# EAGLE design 2MB_Simplified (EAGLE 7.7.0)
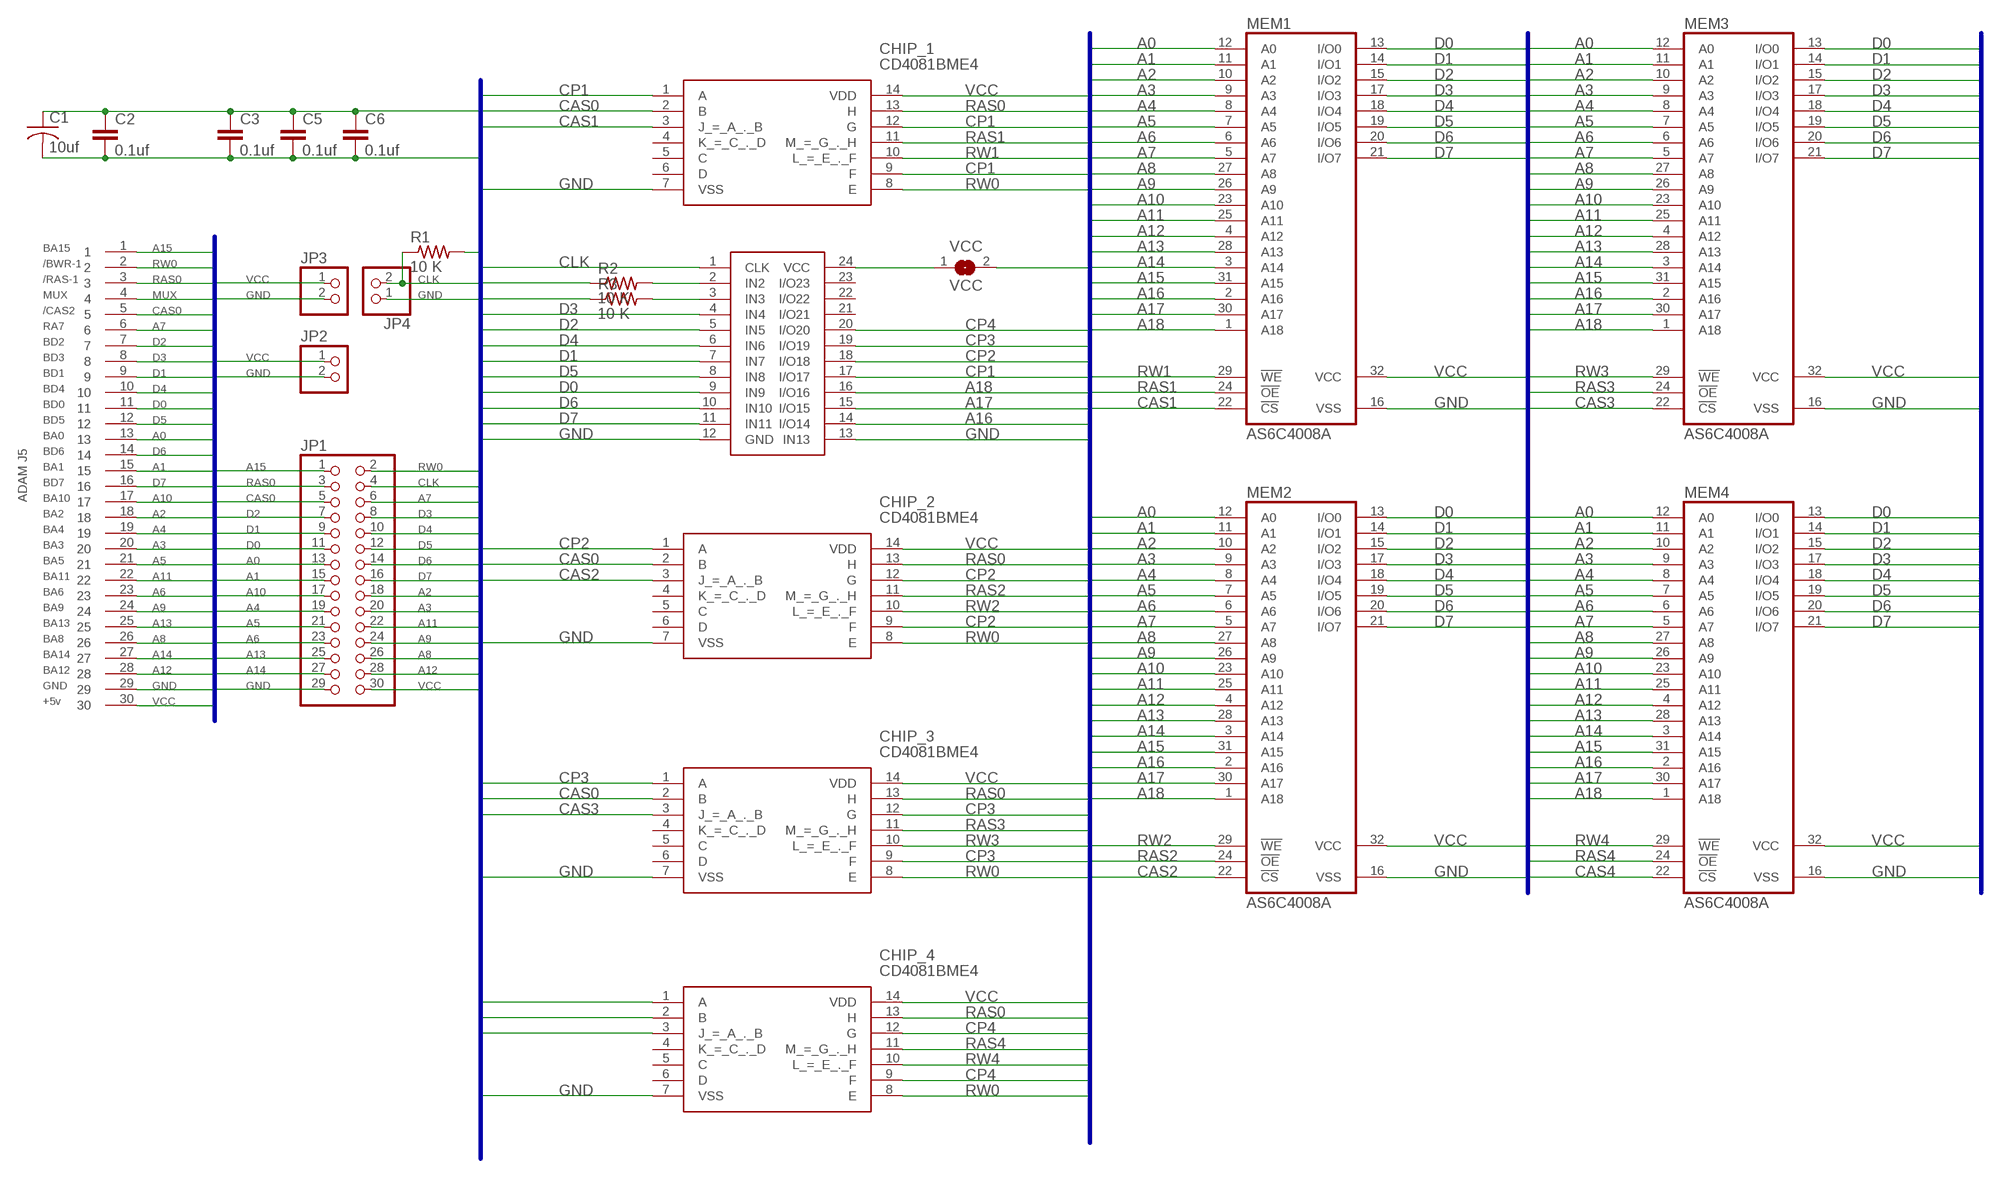
[diagram p0: schematic, sheet 1]

## Parts
C1  10uf  C-US050-025X075  [C050-025X075]
C2  0.1uf  C-EUC1206  [C1206]
C3  0.1uf  C-EUC1206  [C1206]
C5  0.1uf  C-EUC1206  [C1206]
C6  0.1uf  C-EUC1206  [C1206]
CHIP_1  CD4081BME4  [SOIC127P600X175-14N]
CHIP_2  CD4081BME4  [SOIC127P600X175-14N]
CHIP_3  CD4081BME4  [SOIC127P600X175-14N]
CHIP_4  CD4081BME4  [SOIC127P600X175-14N]
JP1  PINHD-2X15  [2X15]
JP2  PINHD-1X2  [1X02]
JP3  PINHD-1X2  [1X02]
JP4  PINHD-1X2  [1X02]
MEM1  AS6C4008A  [SOP32-V2]
MEM2  AS6C4008A  [SOP32-V2]
MEM3  AS6C4008A  [SOP32-V2]
MEM4  AS6C4008A  [SOP32-V2]
R1  10 K  R-US_M1206  [M1206]
R2  10 K  R-US_M1206  [M1206]
R3  10 K  R-US_M1206  [M1206]
U$3  J5CARD  [J5CARD]
U$6  ATF22V10  [SO24W]
VCC  VCC  SJ  [SJ]

## Nets
A0: JP1.13 MEM1.12(A0) MEM2.12(A0) MEM3.12(A0) MEM4.12(A0) U$3.13
A1: JP1.15 MEM1.11(A1) MEM2.11(A1) MEM3.11(A1) MEM4.11(A1) U$3.15
A2: JP1.18 MEM1.10(A2) MEM2.10(A2) MEM3.10(A2) MEM4.10(A2) U$3.18
A3: JP1.20 MEM1.9(A3) MEM2.9(A3) MEM3.9(A3) MEM4.9(A3) U$3.20
A4: JP1.19 MEM1.8(A4) MEM2.8(A4) MEM3.8(A4) MEM4.8(A4) U$3.19
A5: JP1.21 MEM1.7(A5) MEM2.7(A5) MEM3.7(A5) MEM4.7(A5) U$3.21
A6: JP1.23 MEM1.6(A6) MEM2.6(A6) MEM3.6(A6) MEM4.6(A6) U$3.23
A7: JP1.6 MEM1.5(A7) MEM2.5(A7) MEM3.5(A7) MEM4.5(A7) U$3.6
A8: JP1.26 MEM1.27(A8) MEM2.27(A8) MEM3.27(A8) MEM4.27(A8) U$3.26
A9: JP1.24 MEM1.26(A9) MEM2.26(A9) MEM3.26(A9) MEM4.26(A9) U$3.24
A10: JP1.17 MEM1.23(A10) MEM2.23(A10) MEM3.23(A10) MEM4.23(A10) U$3.17
A11: JP1.22 MEM1.25(A11) MEM2.25(A11) MEM3.25(A11) MEM4.25(A11) U$3.22
A12: JP1.28 MEM1.4(A12) MEM2.4(A12) MEM3.4(A12) MEM4.4(A12) U$3.28
A13: JP1.25 MEM1.28(A13) MEM2.28(A13) MEM3.28(A13) MEM4.28(A13) U$3.25
A14: JP1.27 MEM1.3(A14) MEM2.3(A14) MEM3.3(A14) MEM4.3(A14) U$3.27
A15: JP1.1 MEM1.31(A15) MEM2.31(A15) MEM3.31(A15) MEM4.31(A15) U$3.1
A16: MEM1.2(A16) MEM2.2(A16) MEM3.2(A16) MEM4.2(A16) U$6.14(I/O14)
A17: MEM1.30(A17) MEM2.30(A17) MEM3.30(A17) MEM4.30(A17) U$6.15(I/O15)
A18: MEM1.1(A18) MEM2.1(A18) MEM3.1(A18) MEM4.1(A18) U$6.16(I/O16)
CAS0: CHIP_1.2(B) CHIP_2.2(B) CHIP_3.2(B) CHIP_4.2(B) JP1.5 U$3.5
CAS1: CHIP_1.3(J_=_A_._B) MEM1.22(!CS)
CAS2: CHIP_2.3(J_=_A_._B) MEM2.22(!CS)
CAS3: CHIP_3.3(J_=_A_._B) MEM3.22(!CS)
CAS4: CHIP_4.3(J_=_A_._B) MEM4.22(!CS)
CLK: JP1.4 JP4.2 R1.1 U$6.1(CLK)
CP1: CHIP_1.1(A) CHIP_1.9(F) CHIP_1.12(G) U$6.17(I/O17)
CP2: CHIP_2.1(A) CHIP_2.9(F) CHIP_2.12(G) U$6.18(I/O18)
CP3: CHIP_3.1(A) CHIP_3.9(F) CHIP_3.12(G) U$6.19(I/O19)
CP4: CHIP_4.1(A) CHIP_4.9(F) CHIP_4.12(G) U$6.20(I/O20)
D0: JP1.11 MEM1.13(I/O0) MEM2.13(I/O0) MEM3.13(I/O0) MEM4.13(I/O0) U$3.11 U$6.9(IN9)
D1: JP1.9 MEM1.14(I/O1) MEM2.14(I/O1) MEM3.14(I/O1) MEM4.14(I/O1) U$3.9 U$6.7(IN7)
D2: JP1.7 MEM1.15(I/O2) MEM2.15(I/O2) MEM3.15(I/O2) MEM4.15(I/O2) U$3.7 U$6.5(IN5)
D3: JP1.8 MEM1.17(I/O3) MEM2.17(I/O3) MEM3.17(I/O3) MEM4.17(I/O3) U$3.8 U$6.4(IN4)
D4: JP1.10 MEM1.18(I/O4) MEM2.18(I/O4) MEM3.18(I/O4) MEM4.18(I/O4) U$3.10 U$6.6(IN6)
D5: JP1.12 MEM1.19(I/O5) MEM2.19(I/O5) MEM3.19(I/O5) MEM4.19(I/O5) U$3.12 U$6.8(IN8)
D6: JP1.14 MEM1.20(I/O6) MEM2.20(I/O6) MEM3.20(I/O6) MEM4.20(I/O6) U$3.14 U$6.10(IN10)
D7: JP1.16 MEM1.21(I/O7) MEM2.21(I/O7) MEM3.21(I/O7) MEM4.21(I/O7) U$3.16 U$6.11(IN11)
GND [GND]: C1.2 C2.2 C3.2 C5.2 C6.2 CHIP_1.7(VSS) CHIP_2.7(VSS) CHIP_3.7(VSS) CHIP_4.7(VSS) JP1.29 JP2.2 JP3.2 JP4.1 MEM1.16(VSS) MEM2.16(VSS) MEM3.16(VSS) MEM4.16(VSS) R1.2 R2.1 R3.1 U$3.29 U$6.12(GND) U$6.13(IN13)
MUX: U$3.4
N$1: R2.2 U$6.2(IN2)
N$2: R3.2 U$6.3(IN3)
N$3: U$6.24(VCC) VCC.1
RAS0: CHIP_1.13(H) CHIP_2.13(H) CHIP_3.13(H) CHIP_4.13(H) JP1.3 U$3.3
RAS1: CHIP_1.11(M_=_G_._H) MEM1.24(!OE)
RAS2: CHIP_2.11(M_=_G_._H) MEM2.24(!OE)
RAS3: CHIP_3.11(M_=_G_._H) MEM3.24(!OE)
RAS4: CHIP_4.11(M_=_G_._H) MEM4.24(!OE)
RW0: CHIP_1.8(E) CHIP_2.8(E) CHIP_3.8(E) CHIP_4.8(E) JP1.2 U$3.2
RW1: CHIP_1.10(L_=_E_._F) MEM1.29(!WE)
RW2: CHIP_2.10(L_=_E_._F) MEM2.29(!WE)
RW3: CHIP_3.10(L_=_E_._F) MEM3.29(!WE)
RW4: CHIP_4.10(L_=_E_._F) MEM4.29(!WE)
VCC [VCC]: C1.1 C2.1 C3.1 C5.1 C6.1 CHIP_1.14(VDD) CHIP_2.14(VDD) CHIP_3.14(VDD) CHIP_4.14(VDD) JP1.30 JP2.1 JP3.1 MEM1.32(VCC) MEM2.32(VCC) MEM3.32(VCC) MEM4.32(VCC) U$3.30 VCC.2
Unconnected: CHIP_1.4(K_=_C_._D) CHIP_1.5(C) CHIP_1.6(D) CHIP_2.4(K_=_C_._D) CHIP_2.5(C) CHIP_2.6(D) CHIP_3.4(K_=_C_._D) CHIP_3.5(C) CHIP_3.6(D) CHIP_4.4(K_=_C_._D) CHIP_4.5(C) CHIP_4.6(D) U$6.21(I/O21) U$6.22(I/O22) U$6.23(I/O23)

## Buses
D[0..7],A[0..18],RW[0..4],CAS[0..4],RAS[0..4],VCC,GND,MUX,CLK,CP[1..4]

## Library data of the parts
C1 = rcl:C-US: CAPACITOR, American symbol
C2 C3 C5 C6 = rcl:C-EU: CAPACITOR, European symbol
CHIP_1-CHIP_4 = SamacSys_Parts:CD4081BME4: Logic Gates Quad 2-Input Source: Datasheet <http://www.ti.com/general/docs/suppproductinfo.tsp?distId=10&gotoUrl=http://www.ti.com/lit/gpn/cd4073b>; DESCRIPTION: Logic Gates Quad 2-Input; HEIGHT: 1.75mm; MANUFACTURER_NAME: Texas Instruments; MANUFACTURER_PART_NUMBER: CD4081BME4; MOUSER_PART_NUMBER: 595-CD4081BME4; MOUSER_PRICE-STOCK: https://www.mouser.co.uk/ProductDetail/Texas-Instruments/CD4081BME4?qs=HTr%252BoA4jRikg%252BQvASI76tw%3D%3D
JP1 = pinhead:PINHD-2X15: PIN HEADER
JP2-JP4 = pinhead:PINHD-1X2: PIN HEADER
MEM1-MEM4 = memory-bsi:AS6C4008A
R1-R3 = resistor:R-US_: RESISTOR, American symbol
U$3 = ADAM:J5CARD: ADAM J5 Peripheral Card Standard 30-pin J5 edge connector for COLECO ADAM
U$6 = atmel:ATF22V10
VCC = jumper:SJ: SMD solder JUMPER

## Board
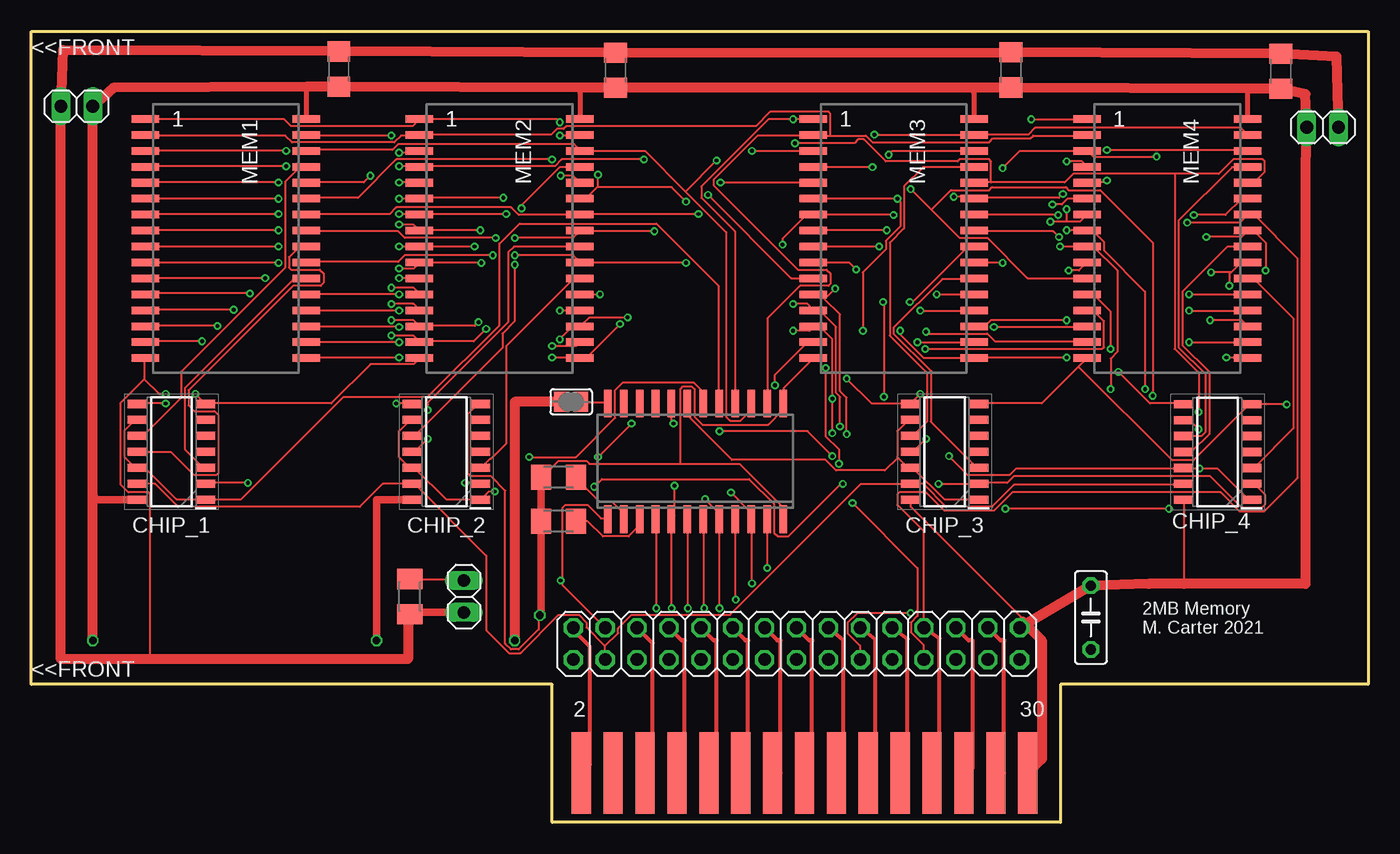
[diagram p1: board, top side]
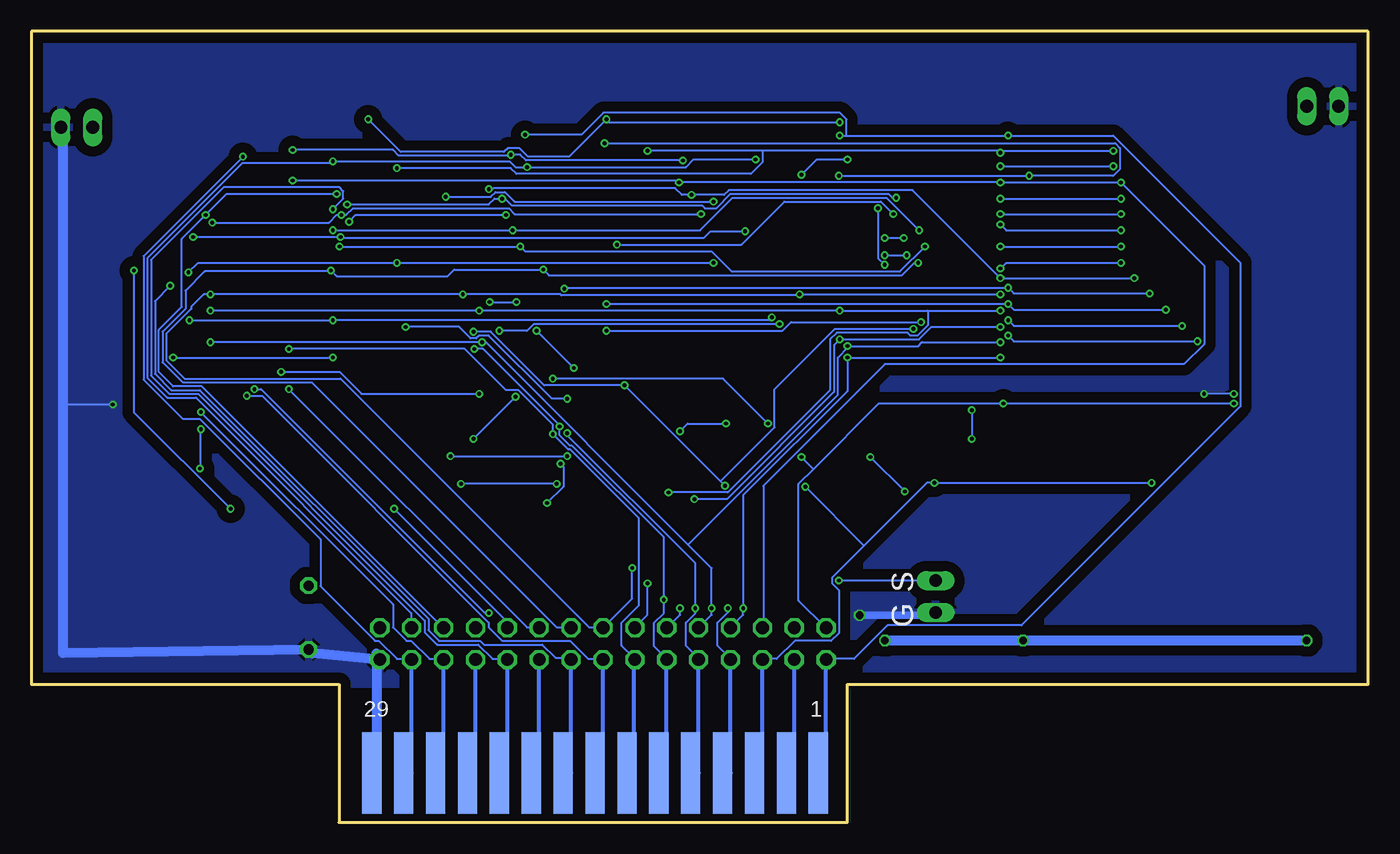
[diagram p2: board, bottom side, seen from below]

Size 106.5 x 63 mm. Coordinates in mm from the lower left corner, seen from the top.
Outline: 41.5,0 41.5,11 0,11 0,63 106.5,63 106.5,11 82,11 82,0 41.5,0
Copper layers (1*16): Top 0.035mm / dielectric 1.5mm / Bottom 0.035mm
Design rules "SeeedStudio_2layer_DRU_no_angle_20140221": minimum track width 6mil, minimum drill 12mil, track to track 6mil, track to pad 6mil, pad to pad 6mil, via to via 6mil, smd to smd 0mil, copper to edge 10mil, drill to drill 10mil, minimum pad ring 10mil, minimum via ring 6mil, stop-mask expansion 2mil, vias tented up to drill 100mil, thermal gap 10mil

### Footprints (pad centres in the part's own frame; a part is rotated, then mirrored left to right if it is on the bottom)
C050-025X075 = drill 0.813 octagon: 1 -2.54,0; 2 2.54,0
C1206 = smd 1.6 x 1.8: 1 -1.4,0; 2 1.4,0
SOIC127P600X175-14N = smd 1.525 x 0.65: 1 -2.712,3.81; 2 -2.712,2.54; 3 -2.712,1.27; 4 -2.712,0; 5 -2.712,-1.27; 6 -2.712,-2.54; 7 -2.712,-3.81; 8 2.712,-3.81; 9 2.712,-2.54; 10 2.712,-1.27; 11 2.712,0; 12 2.712,1.27; 13 2.712,2.54; 14 2.712,3.81
2X15 = drill 1.016 octagon: 1 -17.78,-1.27; 2 -17.78,1.27; 3 -15.24,-1.27; 4 -15.24,1.27; 5 -12.7,-1.27; 6 -12.7,1.27; 7 -10.16,-1.27; 8 -10.16,1.27; 9 -7.62,-1.27; 10 -7.62,1.27; 11 -5.08,-1.27; 12 -5.08,1.27; 13 -2.54,-1.27; 14 -2.54,1.27; 15 0,-1.27; 16 0,1.27; 17 2.54,-1.27; 18 2.54,1.27; 19 5.08,-1.27; 20 5.08,1.27; 21 7.62,-1.27; 22 7.62,1.27; 23 10.16,-1.27; 24 10.16,1.27; 25 12.7,-1.27; 26 12.7,1.27; 27 15.24,-1.27; 28 15.24,1.27; 29 17.78,-1.27; 30 17.78,1.27
1X02 = drill 1.016 long: 1 -1.27,0; 2 1.27,0
SOP32-V2 = smd 0.6 x 2.2: 1 -9.525,-6.4; 2 -8.255,-6.4; 3 -6.985,-6.4; 4 -5.715,-6.4; 5 -4.445,-6.4; 6 -3.175,-6.4; 7 -1.905,-6.4; 8 -0.635,-6.4; 9 0.635,-6.4; 10 1.905,-6.4; 11 3.175,-6.4; 12 4.445,-6.4; 13 5.715,-6.4; 14 6.985,-6.4; 15 8.255,-6.4; 16 9.525,-6.4; 17 9.525,6.4; 18 8.255,6.4; 19 6.985,6.4; 20 5.715,6.4; 21 4.445,6.4; 22 3.175,6.4; 23 1.905,6.4; 24 0.635,6.4; 25 -0.635,6.4; 26 -1.905,6.4; 27 -3.175,6.4; 28 -4.445,6.4; 29 -5.715,6.4; 30 -6.985,6.4; 31 -8.255,6.4; 32 -9.525,6.4
M1206 = smd 1.6 x 2: 1 -1.4,0; 2 1.4,0
J5CARD = smd 1.524 x 6.477 bottom: 1 -73.025,4.445; 3 -70.485,4.445; 5 -67.945,4.445; 7 -65.405,4.445; 9 -62.865,4.445; 11 -60.325,4.445; 13 -57.785,4.445; 15 -55.245,4.445; 17 -52.705,4.445; 19 -50.165,4.445; 21 -47.625,4.445; 23 -45.085,4.445; 25 -42.545,4.445; 27 -40.005,4.445; 29 -37.465,4.445 | smd 1.524 x 6.477: 2 -73.025,4.445; 4 -70.485,4.445; 6 -67.945,4.445; 8 -65.405,4.445; 10 -62.865,4.445; 12 -60.325,4.445; 14 -57.785,4.445; 16 -55.245,4.445; 18 -52.705,4.445; 20 -50.165,4.445; 22 -47.625,4.445; 24 -45.085,4.445; 26 -42.545,4.445; 28 -40.005,4.445; 30 -37.465,4.445
SO24W = smd 0.6 x 2.2: 1 -6.985,-4.6; 2 -5.715,-4.6; 3 -4.445,-4.6; 4 -3.175,-4.6; 5 -1.905,-4.6; 6 -0.635,-4.6; 7 0.635,-4.6; 8 1.905,-4.6; 9 3.175,-4.6; 10 4.445,-4.6; 11 5.715,-4.6; 12 6.985,-4.6; 13 6.985,4.6; 14 5.715,4.6; 15 4.445,4.6; 16 3.175,4.6; 17 1.905,4.6; 18 0.635,4.6; 19 -0.635,4.6; 20 -1.905,4.6; 21 -3.175,4.6; 22 -4.445,4.6; 23 -5.715,4.6; 24 -6.985,4.6
SJ = smd 1.168 x 1.6: 1 -0.762,0; 2 0.762,0

### Placement (x,y rotation side)
C1  84.41,16.32 270 top
C2  46.54,59.9 90 top
C3  24.5,60 90 top
C5  78.04,59.93 90 top
C6  99.54,59.83 90 top
CHIP_1  11.16,29.52 180 top
CHIP_2  33.06,29.52 180 top
CHIP_3  72.76,29.52 180 top
CHIP_4  94.5,29.5 180 top
JP1  60.96,14.24 0 top
JP2  3.62,57.04 180 top
JP3  102.88,55.36 0 top
JP4  34.46,17.99 90 top
MEM1  15.5,46.5 270 top
MEM2  37.3,46.5 270 top
MEM3  68.7,46.5 270 top
MEM4  90.5,46.5 270 top
R1  30.15,17.99 270 top
R2  42,27.5 0 top
R3  42,24 0 top
U$3  116.84,-0.5 0 top
U$6  52.9,28.75 0 top
VCC  43,33.5 180 top

### Tracks (layer width: path | path; a pad name or v marks a point on that pad's centre or on a via)
A0  (via drill 0.3)
  Top 0.152: v17.41,42.13 9.1,42.13 MEM1.12 | v28.68,42.59 30.44,42.59 30.89,42.13 MEM2.12 | 63.2,41.67 64.42,40.45 64.42,34.36 64.96,33.82 v64.96,30.93 | 63.2,41.67 62.82,42.05 62.37,42.05 MEM3.12 | v85.99,37.71 85.99,40.68 84.61,42.05 84.16,42.05 MEM4.12 | 63.2,41.67 v64.04,42.51
  Bottom 0.152: 58.48,4.49 59.01,3.95 U$3.13 | v17.41,42.13 28.23,42.13 v28.68,42.59 63.97,42.59 v64.04,42.51 | JP1.13 58.48,13.1 59.47,14.09 59.47,15.92 58.1,17.29 58.1,24.22 63.58,29.71 63.74,29.71 v64.96,30.93 64.96,31.69 67.7,34.43 68.69,34.43 71.97,37.71 v85.99,37.71
  Bottom 0.305: 58.48,4.49 58.48,12.91 JP1.13
A1  (via drill 0.3)
  Top 0.152: v18.63,43.35 9.1,43.35 MEM1.11 | v29.29,43.35 30.89,43.35 MEM2.11 | v53.91,49.98 60.54,43.35 62.29,43.35 MEM3.11 | v70.06,50.44 71.7,48.8 | 71.7,48.8 73.95,46.55 76.16,46.55 79.36,43.35 84.08,43.35 MEM4.11 | v89.34,33.98 89.34,46.17 85.15,50.36 82.63,50.36 82.41,50.59 76.54,50.59 76.31,50.36 73.26,50.36 71.7,48.8
  Bottom 0.152: v18.63,43.35 v29.29,43.35 36.3,50.36 50.94,50.36 51.32,49.98 v53.91,49.98 54.67,49.98 55.2,50.51 69.68,50.51 69.76,50.44 v70.06,50.44 | v89.34,33.98 88.12,33.98 70.06,15.92 70.06,15.54 68.99,14.47 63.58,14.47 62.14,13.02 61.07,13.02 JP1.15
  Bottom 0.305: U$3.15 60.96,3.95 JP1.15
A2  (via drill 0.3)
  Top 0.152: v19.69,44.57 9.1,44.57 MEM1.10 | v29.29,44.11 30.44,44.11 30.89,44.57 MEM2.10 30.97,44.57 v35.85,44.57 | v65.72,44.03 65.18,44.57 62.37,44.57 MEM3.10 | v82.63,43.96 83.47,43.96 84.08,44.57 MEM4.10
  Top 0.305: U$3.18 64.7,3.95 64.7,14.51 JP1.18
  Bottom 0.152: v19.69,44.57 28.84,44.57 v29.29,44.11 | v35.85,44.57 36.15,44.57 37.14,43.58 65.26,43.58 v65.72,44.03 72.8,44.03 73.34,43.5 82.18,43.5 v82.63,43.96 82.63,43.88 92.69,43.88 94.22,42.36 94.22,40.91 96.05,39.08 96.05,36.64 94.44,35.04 84.16,35.04 64.65,15.54 63.51,15.54 JP1.18
A3  (via drill 0.3)
  Top 0.152: v19.69,45.86 MEM1.9 | v29.29,45.86 MEM2.9 30.97,45.86 v35.31,45.86 | v67.55,45.86 62.37,45.86 MEM3.9 | v81.95,45.86 84.08,45.86 MEM4.9 84.16,45.86 84.61,45.86 86.52,43.96 86.52,37.48 85.99,36.95 v85.99,34.51
  Top 0.305: U$3.20 67.25,3.95 67.25,14.55 JP1.20
  Bottom 0.152: v29.29,45.86 v19.69,45.86 | v81.95,45.86 v67.55,45.86 67.17,45.48 52.31,45.48 50.71,43.88 37.3,43.88 v35.31,45.86 | v85.99,34.51 67.01,15.54 66.1,15.54 JP1.20
A4  (via drill 0.3)
  Top 0.152: v19.69,47.16 9.1,47.16 MEM1.8 | v29.29,47.62 30.44,47.62 30.89,47.16 MEM2.8 30.97,47.16 v35.77,47.16 | v68.16,47.16 62.37,47.16 MEM3.8 | v82.48,47.16 84.08,47.16 MEM4.8 84.16,47.08 84.61,47.08 85.45,46.24 85.45,45.56 88.73,42.28 v88.73,34.51 | v70.06,16.68 65.79,16.68 65.03,15.92 65.03,15.08 66.02,14.09 66.02,13.02 JP1.19
  Bottom 0.152: v19.69,47.16 28.84,47.16 v29.29,47.62 | v82.48,47.16 v68.16,47.16 53.22,47.16 50.63,49.75 38.36,49.75 v35.77,47.16 | v70.06,16.68 70.37,16.68 88.2,34.51 v88.73,34.51
  Bottom 0.305: U$3.19 66.04,3.95 JP1.19
A5  (via drill 0.3)
  Top 0.152: v19.69,48.45 9.1,48.45 MEM1.7 | v29.29,48.45 30.89,48.45 MEM2.7 30.97,48.45 v37.83,48.45 | v68.69,48.38 62.37,48.38 MEM3.7 62.29,48.38 61.76,48.38 59.85,46.47 v59.85,46.02 | 82.48,47.84 83.55,47.84 84.08,48.38 MEM4.7 | 82.48,47.84 v81.19,47.84 | 82.48,47.84 v82.48,48.84
  Bottom 0.152: v29.29,48.45 v19.69,48.45 | v68.69,48.38 80.65,48.38 v81.19,47.84 | v82.48,48.84 81.64,49.67 81.64,50.28 81.95,50.59 91.17,50.59 96.96,44.8 96.96,35.58 95.51,34.13 93.23,34.13 75.17,16.07 75.17,15.15 74.18,14.16 70.9,14.16 69.76,13.02 68.69,13.02 JP1.21 | v37.83,48.45 38.82,49.44 46.52,49.44 49.94,46.02 v59.85,46.02
  Bottom 0.305: U$3.21 68.58,3.95 JP1.21
A6  (via drill 0.3)
  Top 0.152: v19.69,49.67 MEM1.6 | v29.29,49.67 MEM2.6 30.97,49.75 v37.6,49.75 | v81.34,49.22 82.1,49.22 82.56,49.67 84.08,49.67 MEM4.6 | MEM3.6 62.37,49.67 v68.99,49.67 69.22,49.44 69.22,47.46 68.08,46.32 68.08,45.63 66.25,43.81 v66.25,39.16 | v65.41,25.44 70.59,20.26 70.59,16.45 70.06,15.92 70.06,15.15 71.05,14.16 71.05,13.02 JP1.23 | v64.35,28.57 64.35,29.71 63.28,30.77 v63.28,36.19
  Bottom 0.152: v29.29,49.67 v19.69,49.67 | v81.34,49.22 70.06,49.22 69.6,49.67 v68.99,49.67 68.77,49.67 68.23,49.14 53.07,49.14 52.84,48.91 51.93,48.91 50.78,50.05 38.21,50.05 37.91,49.75 v37.6,49.75 | v65.41,25.44 64.12,26.74 64.12,28.34 v64.35,28.57 | v66.25,39.16 v63.28,36.19
  Bottom 0.305: U$3.23 71.12,3.95 JP1.23
A7  (via drill 0.3)
  Top 0.152: v19.69,50.97 9.1,50.97 MEM1.5 | v29.29,50.97 30.89,50.97 MEM2.5 | v54.9,50.97 62.29,50.97 MEM3.5 | v85.68,51.12 85.53,50.97 84.16,50.97 MEM4.5
  Top 0.305: U$3.6 49.5,3.95 49.5,14.27 JP1.6
  Bottom 0.152: v85.68,51.12 55.05,51.12 v54.9,50.97 v29.29,50.97 v19.69,50.97 13.06,44.34 13.06,38.09 14.66,36.49 38.51,36.49 48.19,26.81 48.19,15.54 JP1.6
A8  (via drill 0.3)
  Top 0.152: 74.71,4.33 74.33,3.95 U$3.26 | v41.49,52.8 29.07,52.8 26.02,49.75 21.9,49.75 MEM1.27 | v45.14,51.58 45.14,50.66 45.11,50.63 | 45.11,50.63 44.23,49.75 43.77,49.75 MEM2.27 | v82.18,50.05 81.87,49.75 75.17,49.75 MEM3.27 75.17,49.83 v73.49,49.83 | v92.62,48.38 95.13,48.38 96.43,49.67 96.88,49.67 MEM4.27 | v52.15,49.44 51.01,50.59 45.14,50.59 45.11,50.63
  Top 0.305: 74.71,4.33 75,4.33 75,14.5 74.67,14.5 JP1.26
  Bottom 0.152: v41.49,52.8 43.92,52.8 v45.14,51.58 | v82.18,50.05 90.94,50.05 v92.62,48.38 94.52,46.47 94.52,41.06 96.35,39.23 96.35,35.88 95.21,34.74 92.92,34.74 73.72,15.54 JP1.26 | v52.15,49.44 68,49.44 68.77,50.21 69.53,50.21 69.91,49.83 v73.49,49.83
A9  (via drill 0.3)
  Top 0.152: 72.12,4.26 71.81,3.95 U$3.24 | MEM1.26 21.9,48.45 28.53,48.45 29.07,48.99 38.21,48.99 38.82,48.38 43.7,48.38 MEM2.26 43.77,48.45 v53.15,48.45 | v81.8,48.38 75.17,48.38 MEM3.26 | v92.08,47.77 96.27,47.77 96.88,48.38 MEM4.26 96.96,48.38 97.42,48.38 100.85,44.95 100.85,27.42 98.18,24.76 96.27,24.76 94.75,26.28 78.14,26.28 76.69,24.83 72.73,24.83 71.28,26.28 69.15,26.28 68.99,26.13 68.99,25.29 71.05,23.23 71.05,15.61 JP1.24
  Top 0.305: 72.12,4.26 72.35,4.26 72.35,14.63 JP1.24
  Bottom 0.152: v92.08,47.77 82.79,47.77 82.18,48.38 v81.8,48.38 81.42,48.38 80.88,48.91 68.46,48.91 68,48.45 v53.15,48.45
A10  (via drill 0.3)
  Top 0.152: v36.76,45.18 29.75,45.18 29.22,44.64 21.9,44.64 MEM1.23 | v38.51,45.18 43.16,45.18 43.7,44.64 MEM2.23 43.77,44.57 v52.15,44.57 | v77.38,44.57 75.17,44.57 MEM3.23 | 95.44,43.81 95.59,43.81 96.35,44.57 96.88,44.57 MEM4.23 | 95.44,43.81 v93.99,43.81 | 95.44,43.81 v95.44,42.74
  Bottom 0.152: v38.51,45.18 v36.76,45.18 | v93.99,43.81 93.23,44.57 v77.38,44.57 v52.15,44.57 | v95.44,42.74 96.66,41.52 96.66,35.73 95.36,34.43 93.07,34.43 74.86,16.22 74.86,15.31 74.02,14.47 70.75,14.47 70.44,14.16 65.79,14.16 64.73,13.1 63.58,13.1 JP1.17
  Bottom 0.305: U$3.17 63.5,3.95 JP1.17
A11  (via drill 0.3)
  Top 0.152: v36.99,46.55 29.75,46.55 29.22,47.08 21.9,47.08 MEM1.25 | v38.51,46.55 43.16,46.55 43.7,47.08 MEM2.25 43.77,47.08 v49.64,47.08 | v81.87,46.62 81.42,47.08 75.17,47.08 MEM3.25 | v93.61,46.62 96.43,46.62 96.88,47.08 MEM4.25 96.96,47.08 97.42,47.08 98.33,46.17 v98.33,43.96 | v90.64,24.98 v77.61,24.98
  Top 0.305: U$3.22 69.8,3.95 69.8,14.59 JP1.22
  Bottom 0.152: v38.51,46.55 v36.99,46.55 | v93.61,46.62 v81.87,46.62 81.8,46.55 52.92,46.55 52.38,47.08 v49.64,47.08 | v77.61,24.98 68.61,15.99 68.61,15.54 JP1.22 | v90.64,24.98 98.33,32.68 v98.33,43.96
A12  (via drill 0.3)
  Top 0.152: v20.3,52.26 9.1,52.26 MEM1.4 | v29.29,52.26 30.89,52.26 MEM2.4 30.97,52.26 41.72,52.26 42.25,52.8 v48.8,52.8 | v67.01,52.19 62.37,52.19 MEM3.4 | v82.48,52.65 83.7,52.65 84.08,52.26 MEM4.4
  Top 0.305: U$3.28 77.5,3.95 77.5,14.5 77.21,14.5 JP1.28
  Bottom 0.152: v29.29,52.26 v20.3,52.26 | v48.8,52.8 53.75,52.8 54.36,52.19 v67.01,52.19 67.93,52.19 68.39,52.65 v82.48,52.65 82.63,52.49 89.72,52.49 97.27,44.95 97.27,35.42 95.66,33.82 93.38,33.82 76.23,16.68 76.23,15.54 JP1.28
A13  (via drill 0.3)
  Top 0.152: v27.01,51.5 26.48,50.97 21.9,50.97 MEM1.28 | v42.17,51.5 43.16,51.5 43.7,50.97 MEM2.28 | 76.46,50.97 82.33,50.97 83.02,51.65 91.09,51.65 | 76.46,50.97 75.17,50.97 MEM3.28 | 91.09,51.65 94.6,51.65 95.74,52.8 98.1,52.8 98.25,52.65 98.25,51.81 97.42,50.97 96.96,50.97 MEM4.28 | v93,32.68 93,35.8 91.09,37.71 91.09,51.65 | v60.84,54.09 65.56,54.09 65.87,54.4 66.33,54.4 68.08,52.65 73.8,52.65 73.95,52.8 76.31,52.8 76.46,52.65 76.46,50.97
  Bottom 0.152: v42.17,51.5 v27.01,51.5 20.3,51.5 19.77,52.03 19.77,53.71 20.15,54.09 v60.84,54.09 | v93,32.68 77.68,17.36 77.68,15.54 76.61,14.47 76.23,14.47 74.79,13.02 73.8,13.02 JP1.25
  Bottom 0.305: U$3.25 73.66,3.95 JP1.25
A14  (via drill 0.3)
  Top 0.152: v20.3,53.48 MEM1.3 | v29.29,53.33 30.74,53.33 MEM2.3 | v57.41,53.48 MEM3.3 | v77.38,52.11 78.75,53.48 84.08,53.48 MEM4.3 84.16,53.48 84.61,53.03 v89.64,53.03
  Bottom 0.152: v20.3,53.48 29.14,53.48 v29.29,53.33 29.22,53.48 48.27,53.48 | 48.27,53.48 v57.41,53.48 | v77.38,52.11 68.31,52.11 67.85,51.65 49.18,51.65 48.27,52.57 48.27,53.48 | v89.64,53.03 97.57,45.1 97.57,35.27 94.44,32.15 93.07,32.15 83.47,22.55 83.47,18.81 79.13,14.47 78.82,14.47 77.38,13.02 76.31,13.02 JP1.27
  Bottom 0.305: U$3.27 76.2,3.95 JP1.27
A15  (via drill 0.3)
  Top 0.152: MEM4.31 96.88,54.78 96.35,55.31 79.97,55.31 79.43,54.78 75.17,54.78 MEM3.31 75.09,54.78 v67.17,54.78 | v28.68,54.7 21.9,54.7 MEM1.31 | v42.1,54.7 43.7,54.7 MEM2.31
  Bottom 0.152: 43.24,4.49 43.77,3.95 U$3.1 | v42.1,54.7 41.56,54.7 | 41.56,54.7 v28.68,54.7 20.3,54.7 10.17,44.57 10.17,33.14 27.62,15.69 38.29,15.69 40.95,13.02 43.09,13.02 JP1.1 | v67.17,54.78 62.67,54.78 60.92,56.53 42.1,56.53 41.56,56 41.56,54.7
  Bottom 0.305: 43.24,4.49 43.18,4.49 JP1.1
A16
  Top 0.152: MEM1.2 9.1,54.7 20.23,54.7 20.76,54.17 28.91,54.17 29.45,54.7 30.89,54.7 MEM2.2 30.97,54.78 41.41,54.78 41.87,55.24 42.4,55.24 42.63,55.46 57.72,55.46 58.86,56.61 63.51,56.61 63.66,56.45 63.66,54.7 | U$6.14 58.63,33.37 58.63,40.15 61.22,42.74 63.51,42.74 63.66,42.89 63.66,43.73 63.36,44.03 61.07,44.03 54.36,50.74 54.36,51.2 57.87,54.7 62.29,54.7 MEM3.2 62.37,54.7 63.66,54.7 | 63.66,54.7 66.48,54.7 67.01,54.17 76.31,54.17 76.61,54.47 79.59,54.47 79.81,54.7 84.08,54.7 MEM4.2
A17  (via drill 0.3)
  Top 0.152: MEM1.30 21.9,53.56 28.76,53.56 29.22,54.02 43.24,54.02 43.7,53.56 MEM2.30 43.77,53.48 48.88,53.48 52.12,50.24 | 52.12,50.24 55.35,47.01 55.35,32.3 55.66,31.99 56.5,31.99 57.34,32.83 57.34,33.29 U$6.15 | v68.31,53.18 68.61,53.48 MEM3.30 | 52.12,50.24 v54.59,52.72 | v85.68,53.56 96.88,53.56 MEM4.30
  Bottom 0.152: v54.59,52.72 67.09,52.72 67.55,53.18 v68.31,53.18 68.39,53.1 77.22,53.1 77.68,53.56 v85.68,53.56
A18  (via drill 0.3)
  Top 0.152: MEM1.1 9.1,56 20.15,56 20.68,55.46 30.36,55.46 30.89,56 MEM2.1 30.97,56 41.87,56 v42.1,55.77 | U$6.16 56.04,33.37 56.04,47.08 53.37,49.75 53.37,50.66 58.71,56 v60.69,56 62.29,56 MEM3.1 | v79.66,56 84.08,56 MEM4.1
  Bottom 0.152: v79.66,56 77.07,53.41 68.84,53.41 68.54,53.71 67.62,53.71 66.94,53.03 63.66,53.03 v60.69,56 60.69,55.92 60.54,55.77 v42.1,55.77
CAS0  (via drill 0.3)
  Top 0.152: CHIP_4.2 97.27,26.89 97.49,26.89 98.25,26.13 98.25,25.29 98.03,25.06 96.43,25.06 93.91,27.57 78.29,27.57 77.76,27.04 75.55,27.04 CHIP_3.2 75.39,26.96 v72.27,26.96 | v17.25,27.04 13.9,27.04 CHIP_1.2 | v34.55,27.04 35.77,27.04 CHIP_2.2 | v64.65,26.96 64.5,26.96 60.31,22.77 59.47,22.77 59.16,23.08 59.16,25.36 57.18,27.35 45.45,27.35 v44.84,26.74
  Bottom 0.152: v17.25,27.04 v34.55,27.04 35.16,27.04 40.15,22.05 | 40.15,22.05 42.7,19.5 42.7,19.04 42.17,18.51 42.17,15.08 42.78,14.47 45.68,14.47 47.12,13.02 48.12,13.02 JP1.5 | v64.65,26.96 v72.27,26.96 | 40.15,22.05 v44.84,26.74
  Bottom 0.305: U$3.5 48.26,3.95 JP1.5
CAS1
  Top 0.152: CHIP_1.3 13.83,28.26 13.67,28.26 12.22,29.71 12.22,34.59 20.91,43.27 21.83,43.27 MEM1.22
CAS2
  Top 0.152: CHIP_2.3 35.85,28.26 36.53,28.95 36.61,28.95 37.83,30.17 37.83,37.94 43.16,43.27 43.7,43.27 MEM2.22
CAS3
  Top 0.152: CHIP_3.3 75.32,28.26 71.66,31.92 71.66,35.96 68.69,38.93 68.69,39.39 72.58,43.27 75.09,43.27 MEM3.22
CAS4
  Top 0.152: CHIP_4.3 97.27,28.26 97.42,28.26 100.54,31.38 100.54,40.15 97.42,43.27 96.96,43.27 MEM4.22
CLK  (via drill 0.3)
  Top 0.152: R1.1 30.21,19.34 34.32,19.34 34.4,19.27 JP4.2 | 42.32,19.27 42.32,18.89 45.68,15.54 JP1.4 | 42.32,19.27 42.32,25.06 42.55,25.29 44.31,25.29 45.37,24.22 45.91,24.22 U$6.1 | 42.32,19.27 v42.17,19.27
  Bottom 0.152: v42.17,19.27 34.48,19.27 JP4.2
CP1
  Top 0.152: CHIP_1.9 8.41,31.99 8.19,31.99 7.42,31.23 7.42,29.1 8.26,28.26 8.41,28.26 CHIP_1.12 8.49,28.18 9.1,28.18 11.54,25.75 13.83,25.75 CHIP_1.1 13.9,25.75 16.72,25.75 24.88,33.9 31.58,33.9 37.3,39.62 37.3,46.09 38.9,47.69 49.79,47.69 54.74,42.74 54.74,33.37 U$6.17
CP2  (via drill 0.3)
  Top 0.152: CHIP_2.9 30.29,31.99 30.13,31.99 29.29,31.16 29.29,29.1 30.13,28.26 30.29,28.26 CHIP_2.12 30.36,28.18 30.59,28.18 33.03,25.75 35.77,25.75 CHIP_2.1 35.85,25.75 36.46,26.36 v36.91,26.36 | v39.66,29.1 43.39,29.1 46.52,32.22 46.52,34.43 47.12,35.04 52.76,35.04 53.53,34.28 53.53,33.37 U$6.18
  Bottom 0.152: v36.91,26.36 v39.66,29.1
CP3
  Top 0.152: 69.03,29.06 68.99,29.1 68.99,31.16 69.83,31.99 69.98,31.99 CHIP_3.9 | 69.03,29.06 69.83,28.26 69.98,28.26 CHIP_3.12 70.06,28.18 70.29,28.18 72.73,25.75 75.47,25.75 CHIP_3.1 | 69.03,29.06 68,28.03 64.12,28.03 63.28,28.87 55.81,28.87 52.31,32.38 52.31,33.29 U$6.19
CP4  (via drill 0.3)
  Top 0.152: CHIP_4.1 97.19,25.75 96.96,25.75 94.52,28.18 v93.07,28.18 91.85,28.18 CHIP_4.12 91.78,28.18 78.44,28.18 77.91,27.65 74.63,27.65 v73.11,29.18 | v93,31.31 92.31,31.99 91.85,31.99 CHIP_4.9 | v51.16,31.77 51.01,31.92 51.01,33.29 U$6.20 | v54.82,31.16 61.83,31.16 v63.81,29.18
  Bottom 0.152: v93,31.31 93,28.26 v93.07,28.18 | v51.16,31.77 54.21,31.77 v54.82,31.16 | v73.11,29.18 v63.81,29.18
D0  (via drill 0.3)
  Top 0.152: v16.11,40.83 9.1,40.83 MEM1.13 | v28.68,41.29 30.44,41.29 30.89,40.83 MEM2.13 | v56.12,17.75 56.12,24.15 U$6.9 | v64.42,31.54 64.42,33.9 64.12,34.2 64.12,39.46 62.82,40.76 62.37,40.76 MEM3.13 62.29,40.83 61.83,41.29 v60.69,41.29 | v71.2,37.71 85.3,37.71 85.45,37.86 85.45,39.92 84.61,40.76 84.16,40.76 MEM4.13
  Bottom 0.152: v16.11,40.83 28.23,40.83 v28.68,41.29 v60.69,41.29 | JP1.11 55.96,13.1 56.88,14.01 56.88,15.92 56.12,16.68 v56.12,17.75 56.12,22.7 63.43,30.01 63.58,30.01 64.42,30.85 v64.42,31.54 64.42,31.61 70.52,37.71 v71.2,37.71
  Bottom 0.305: U$3.11 55.88,3.95 JP1.11
D1  (via drill 0.3)
  Top 0.152: v14.82,39.54 9.1,39.54 MEM1.14 | v28.68,40 30.44,40 30.89,39.54 MEM2.14 30.97,39.54 35.31,39.54 v35.62,39.84 | v53.6,17.06 53.6,24.15 U$6.7 | v63.81,31 v63.81,33.75 63.81,38.47 62.82,39.46 62.37,39.46 MEM3.14 62.29,39.46 61.98,39.16 v60.69,39.16 | v76.69,39.46 84.08,39.46 MEM4.14
  Bottom 0.152: v14.82,39.54 28.23,39.54 v28.68,40 | JP1.9 53.37,13.1 54.36,14.09 54.36,15.92 53.6,16.68 v53.6,17.06 53.6,20.64 63.81,30.85 v63.81,31 | v76.69,39.46 72.42,39.46 71.51,38.55 71.05,38.55 70.82,38.78 70.06,38.78 65.03,33.75 v63.81,33.75 | v35.62,39.84 45.98,39.84 46.67,39.16 v60.69,39.16
  Bottom 0.305: U$3.9 53.34,3.95 JP1.9
D2  (via drill 0.3)
  Top 0.152: v13.6,38.32 9.1,38.32 MEM1.15 | v28.68,38.78 30.44,38.78 30.89,38.32 MEM2.15 30.97,38.32 35.24,38.32 v36.23,39.31 | v51.01,17.06 51.01,24.15 U$6.5 51.01,24.22 51.24,24.45 v51.24,26.81 | v59.24,34.81 59.24,35.65 61.83,38.24 MEM3.15 | v71.28,39.08 71.43,38.93 76.16,38.93 76.77,38.32 84.08,38.32 MEM4.15
  Bottom 0.152: v13.6,38.32 28.23,38.32 v28.68,38.78 | v51.01,17.06 51.01,16.75 51.85,15.92 51.85,14.09 50.86,13.1 JP1.7 | v51.24,26.81 51.58,27.16 | 51.58,27.16 v59.24,34.81 65.64,34.81 69.91,39.08 v71.28,39.08 | v36.23,39.31 42.48,39.31 47.28,34.51 47.28,31.46 51.58,27.16
  Bottom 0.305: U$3.7 50.8,3.95 JP1.7
D3  (via drill 0.3)
  Top 0.152: v82.48,37.02 75.17,37.02 MEM3.17 75.09,37.02 71.05,37.02 69.22,38.85 v69.22,39.16 | v95.21,37.02 96.88,37.02 MEM4.17 | v49.79,17.06 49.79,24.15 U$6.4 | v29.29,37.02 21.9,37.02 MEM1.17 | v41.49,37.02 43.7,37.02 MEM2.17 43.77,37.02 44.23,37.02 v46.9,39.69
  Top 0.305: U$3.8 52.05,3.95 52.05,14.5 51.81,14.5 JP1.8
  Bottom 0.152: v95.21,37.02 v82.48,37.02 | JP1.8 50.78,15.54 49.79,16.53 v49.79,17.06 49.79,26.05 41.49,34.36 v41.49,37.02 v29.29,37.02 | v69.22,39.16 67.01,39.16 66.48,39.69 v46.9,39.69
D4  (via drill 0.3)
  Top 0.152: v29.29,38.24 MEM1.18 | v41.49,37.94 43.39,37.94 MEM2.18 | v52.31,17.06 52.31,24.15 U$6.6 | v70.59,38.24 MEM3.18 | v92.23,38.24 96.88,38.24 MEM4.18
  Top 0.305: U$3.10 54.6,3.95 54.6,14.5 54.35,14.5 JP1.10
  Bottom 0.152: v29.29,38.24 35.54,38.24 35.85,37.94 v41.49,37.94 41.49,37.79 42.25,37.02 42.25,34.05 54.17,22.13 | JP1.10 53.3,15.54 52.31,16.53 v52.31,17.06 52.31,20.26 54.17,22.13 | 54.17,22.13 70.29,38.24 v70.59,38.24 v92.23,38.24
D5  (via drill 0.3)
  Top 0.152: v82.48,40 76.46,40 76,39.54 75.17,39.54 MEM3.19 | v93.91,40 96.43,40 96.88,39.54 MEM4.19 | v54.82,17.06 54.82,24.15 U$6.8 54.74,24.22 54.74,24.68 v53.68,25.75 | v29.29,39.46 21.9,39.46 MEM1.19 | v42.1,38.47 43.09,39.46 43.7,39.46 MEM2.19 43.77,39.54 44.46,40.22 v47.51,40.22
  Top 0.305: U$3.12 57.1,3.95 57.1,14.5 56.89,14.5 JP1.12
  Bottom 0.152: v93.91,40 v82.48,40 47.73,40 v47.51,40.22 | v54.82,17.06 54.82,16.53 55.81,15.54 JP1.12 | v29.29,39.46 34.78,39.46 35.77,38.47 v42.1,38.47 42.55,38.01 42.55,34.28 51.09,25.75 v53.68,25.75
D6  (via drill 0.3)
  Top 0.152: v57.41,19.04 57.41,24.15 U$6.10 57.34,24.22 57.34,24.68 v55.74,26.28 | v29.29,40.76 21.9,40.76 MEM1.20 | v42.1,40.76 43.7,40.76 MEM2.20 | v70.82,40.76 75.09,40.76 MEM3.20 | v92.23,40.76 96.88,40.76 MEM4.20
  Top 0.305: U$3.14 59.7,3.95 59.7,14.5 59.43,14.5 JP1.14
  Bottom 0.152: v57.41,19.04 57.41,16.53 58.4,15.54 JP1.14 | 35.09,40.76 v42.1,40.76 v70.82,40.76 v92.23,40.76 | 35.09,40.76 v29.29,40.76 | v55.74,26.28 51.01,26.28 42.86,34.43 42.86,38.47 42.32,39.01 36.69,39.01 36.46,38.78 35.92,38.78 35.09,39.62 35.09,40.76
D7  (via drill 0.3)
  Top 0.152: v58.63,20.26 58.63,24.15 U$6.11 | v29.29,42.05 MEM1.21 | v45.3,42.05 43.77,42.05 MEM2.21 | v72.12,42.05 MEM3.21 | v92.23,42.05 96.88,42.05 MEM4.21
  Top 0.305: U$3.16 62.2,3.95 62.2,14.5 61.97,14.5 JP1.16
  Bottom 0.152: v58.63,20.26 58.63,17.82 60.92,15.54 JP1.16 60.99,15.54 62.06,15.54 81.87,35.35 94.29,35.35 95.74,36.8 95.74,38.93 93.76,40.91 93.76,41.06 92.77,42.05 v92.23,42.05 v72.12,42.05 64.35,42.05 64.27,41.98 45.37,41.98 v45.3,42.05 v29.29,42.05
GND  (via drill 0.3, 0.6)
  Top 0.152: 2.55,56.68 JP2.2 | 83.43,36.3 84.08,36.95 MEM4.16 | 83.43,36.3 80.5,33.37 75.55,33.37 CHIP_3.7 | 83.43,36.3 90.86,28.87 92.62,28.87 97.04,33.29 97.19,33.29 CHIP_4.7 97.27,33.29 v100.01,33.29 | MEM2.16 30.89,36.95 30.44,36.49 27.01,36.49 23.88,33.37 13.9,33.37 CHIP_1.7 13.83,33.37 v13.06,34.13 | MEM3.16 62.29,36.95 59.93,34.59 59.93,33.37 U$6.13 59.85,33.29 59.85,32.83 58.71,31.69 53.45,31.69 52.84,32.3 52.84,34.51 52.61,34.74 51.93,34.74 51.7,34.51 51.7,28.57 | CHIP_2.7 35.77,33.29 35.54,33.29 34.78,32.53 34.78,27.8 35.01,27.57 36.61,27.57 37.75,26.43 37.75,14.24 38.21,13.78 38.82,13.78 40.42,15.38 40.42,16.22 v40.5,16.5 | 8.99,35.31 7.12,33.44 7.12,26.89 7.73,26.28 9.33,26.28 9.48,26.13 9.48,13 | 8.99,35.31 9.03,35.35 9.03,36.95 MEM1.16 | 51.7,28.57 44.46,28.57 44.23,28.79 42.02,28.79 40.88,27.65 R2.1 | 51.7,28.57 56.42,28.57 59.85,25.14 59.85,24.22 U$6.12 | v10.7,34.13 10.17,34.13 8.99,35.31
  Top 0.61: JP4.1 30.28,16.72 R1.2 | v40.5,16.5 40.6,16.6 R3.1 R2.1
  Top 0.813: JP3.2 104,61 C6.2 C5.2 C2.2 C3.2 2.5,61.5 JP2.2 2.35,13 9.48,13 30,13 30,16.59 R1.2
  Bottom 0.152: v10.7,34.13 v13.06,34.13 | 104,33.29 v100.01,33.29
  Bottom 0.61: v40.5,16.5 34.68,16.5 JP4.1
  Bottom 0.813: U$3.29 79.38,4 79,4 79,13.47 JP1.29 84.1,13.47 C1.2 104,13.5 104,33.29 104,54 JP3.2
  pour Bottom (isolate 0.813): 0,11 0,63 106.5,63 106.5,11
N$1
  Top 0.152: R2.2 43.47,27.5 43.47,27.35 45.3,25.52 46.29,25.52 47.12,24.68 47.12,24.22 U$6.2
N$2
  Top 0.152: R3.2 43.47,23.99 44.31,23.99 45.52,22.77 47.58,22.77 48.42,23.61 48.42,24.15 U$6.3
N$3
  Top 0.152: VCC.1 43.77,33.44 45.83,33.44 45.91,33.37 U$6.24
RAS0
  Top 0.152: CHIP_4.13 91.78,26.89 78.29,26.89 76.54,25.14 72.88,25.14 71.05,26.96 70.06,26.96 CHIP_3.13 69.98,26.96 66.1,26.96 55.66,16.53 47.81,16.53 46.74,15.46 46.74,15.08 45.68,14.01 | CHIP_1.13 8.49,26.96 9.86,26.96 11.69,25.14 26.17,25.14 28,26.96 30.29,26.96 CHIP_2.13 30.36,26.96 30.51,26.96 36.23,21.25 36.23,15.31 38.06,13.48 38.97,13.48 42.02,16.53 43.62,16.53 44.23,15.92 44.23,15.54 45.68,14.09 45.68,14.01 | 45.68,14.01 45.68,13.02 JP1.3
  Bottom 0.305: U$3.3 45.72,3.95 JP1.3
RAS1
  Top 0.152: CHIP_1.11 8.49,29.48 11.16,29.48 12.99,27.65 14.74,27.65 14.89,27.8 14.89,32.45 14.59,32.76 12.99,32.76 12.53,33.21 12.53,34.43 20.84,42.74 23.05,42.74 23.27,42.97 23.27,43.73 22.97,44.03 20.68,44.03 20.53,44.19 20.53,45.02 21.37,45.86 21.83,45.86 MEM1.24
RAS2  (via drill 0.3)
  Top 0.152: v31.58,30.55 30.59,29.56 30.36,29.56 CHIP_2.11 | v31.58,32.83 31.58,33.44 37.98,39.84 37.98,45.41 38.44,45.86 MEM2.24
  Bottom 0.152: v31.58,32.83 v31.58,30.55
RAS3  (via drill 0.3)
  Top 0.152: v71.28,30.55 70.29,29.56 70.06,29.56 CHIP_3.11 | v67.93,33.9 67.93,41.37 v67.85,41.44 | v69.98,41.44 70.21,41.44 74.63,45.86 MEM3.24
  Bottom 0.152: v67.93,33.9 v71.28,30.55 | v69.98,41.44 v67.85,41.44
RAS4
  Top 0.152: CHIP_4.11 91.85,29.56 92.46,29.56 93.84,30.93 93.84,35.88 91.7,38.01 91.7,42.28 95.28,45.86 96.88,45.86 MEM4.24
RW0  (via drill 0.3)
  Top 0.152: v70.82,34.13 70.06,33.37 CHIP_3.8 69.98,33.37 66.94,33.37 v64.96,35.35 | v86.6,35.88 89.11,33.37 91.78,33.37 CHIP_4.8 | v10.7,33.37 8.49,33.37 CHIP_1.8 | v29.07,33.37 30.29,33.37 CHIP_2.8 | v45.14,29.1 v47.81,31.77
  Top 0.305: U$3.2 44.5,4.63 44.5,14 43.18,15.32 JP1.2
  Bottom 0.152: v70.82,34.13 80.2,34.13 81.95,35.88 v86.6,35.88 | v10.7,33.37 v29.07,33.37 38.97,33.37 44.19,28.15 | 44.19,28.15 45.37,26.96 45.37,17.67 43.24,15.54 JP1.2 | v64.96,35.35 51.39,35.35 v47.81,31.77 | 44.19,28.15 v45.14,29.1
RW1
  Top 0.152: CHIP_1.10 8.49,30.85 8.95,30.85 11.92,33.82 11.92,35.88 20.23,44.19 20.23,51.05 21.37,52.19 21.83,52.19 MEM1.29
RW2  (via drill 0.3)
  Top 0.152: v38.51,44.41 38.51,39.92 37.52,38.93 37.52,37.79 30.59,30.85 30.36,30.85 CHIP_2.10 | v39.05,48.91 39.05,49.14 42.1,52.19 43.7,52.19 MEM2.29
  Bottom 0.152: v38.51,44.41 39.05,44.95 v39.05,48.91
RW3
  Top 0.152: CHIP_3.10 70.06,30.85 70.29,30.85 71.36,31.92 71.36,35.8 68.39,38.78 68.39,46.17 69.53,47.31 69.53,50.66 71.05,52.19 75.09,52.19 MEM3.29
RW4
  Top 0.152: CHIP_4.10 91.85,30.77 93.23,30.77 93.53,31.08 93.53,35.73 91.4,37.86 91.4,47.92 95.66,52.19 96.88,52.19 MEM4.29
VCC  (via drill 0.6)
  Top 0.152: 21.9,56.07 MEM1.32 | 21.9,58.21 21.9,58.59 | 43.7,56.07 MEM2.32 | 43.7,58.13 43.7,58.51 | 75.09,56.07 MEM3.32 | 75.09,58.13 75.09,58.53 | 96.88,56.07 MEM4.32 | 96.88,58.05 96.89,58.44 | CHIP_3.14 70.06,25.67 70.06,25.14 78.82,16.37 78.99,16.01 | 91.85,19 91.85,25.67 CHIP_4.14
  Top 0.406: 21.9,58.21 21.9,56.07 | 43.7,58.13 43.7,56.07 | 75.09,58.13 75.09,56.07 | 96.88,58.05 96.88,56.07
  Top 0.61: CHIP_1.14 5.18,25.71 4.89,26 | CHIP_2.14 27.5,25.71 v27.5,14.5
  Top 0.813: U$3.30 80.43,5 80.5,5 80.5,14.5 78.99,16.01 JP1.30 C1.1 89,19 91.85,19 101.5,19 101.5,52.5 JP3.1 101.5,58 C6.1 96.89,58.44 C5.1 75.09,58.53 C2.1 43.7,58.51 C3.1 21.9,58.59 6.5,58.5 JP2.1 4.89,26 v4.89,14.5 | VCC.2 38.5,33.5 v38.5,14.5
  Bottom 0.152: 4.91,56.99 JP2.1 | 78.67,15.54 JP1.30 | 84.46,18.89 C1.1
  Bottom 0.813: v38.5,14.5 v27.5,14.5 v4.89,14.5

### Text on the board
tPlace: 2MB Memory / M. Carter 2021
bPlace: S | G